# Altium schematic sheet Printing2.SchDoc
size A3; Organization: Altium Limited; Address1: L3, 12a Rodborough Rd; Address2: Frenchs Forest; Address3: NSW; Address4: Australia 2086
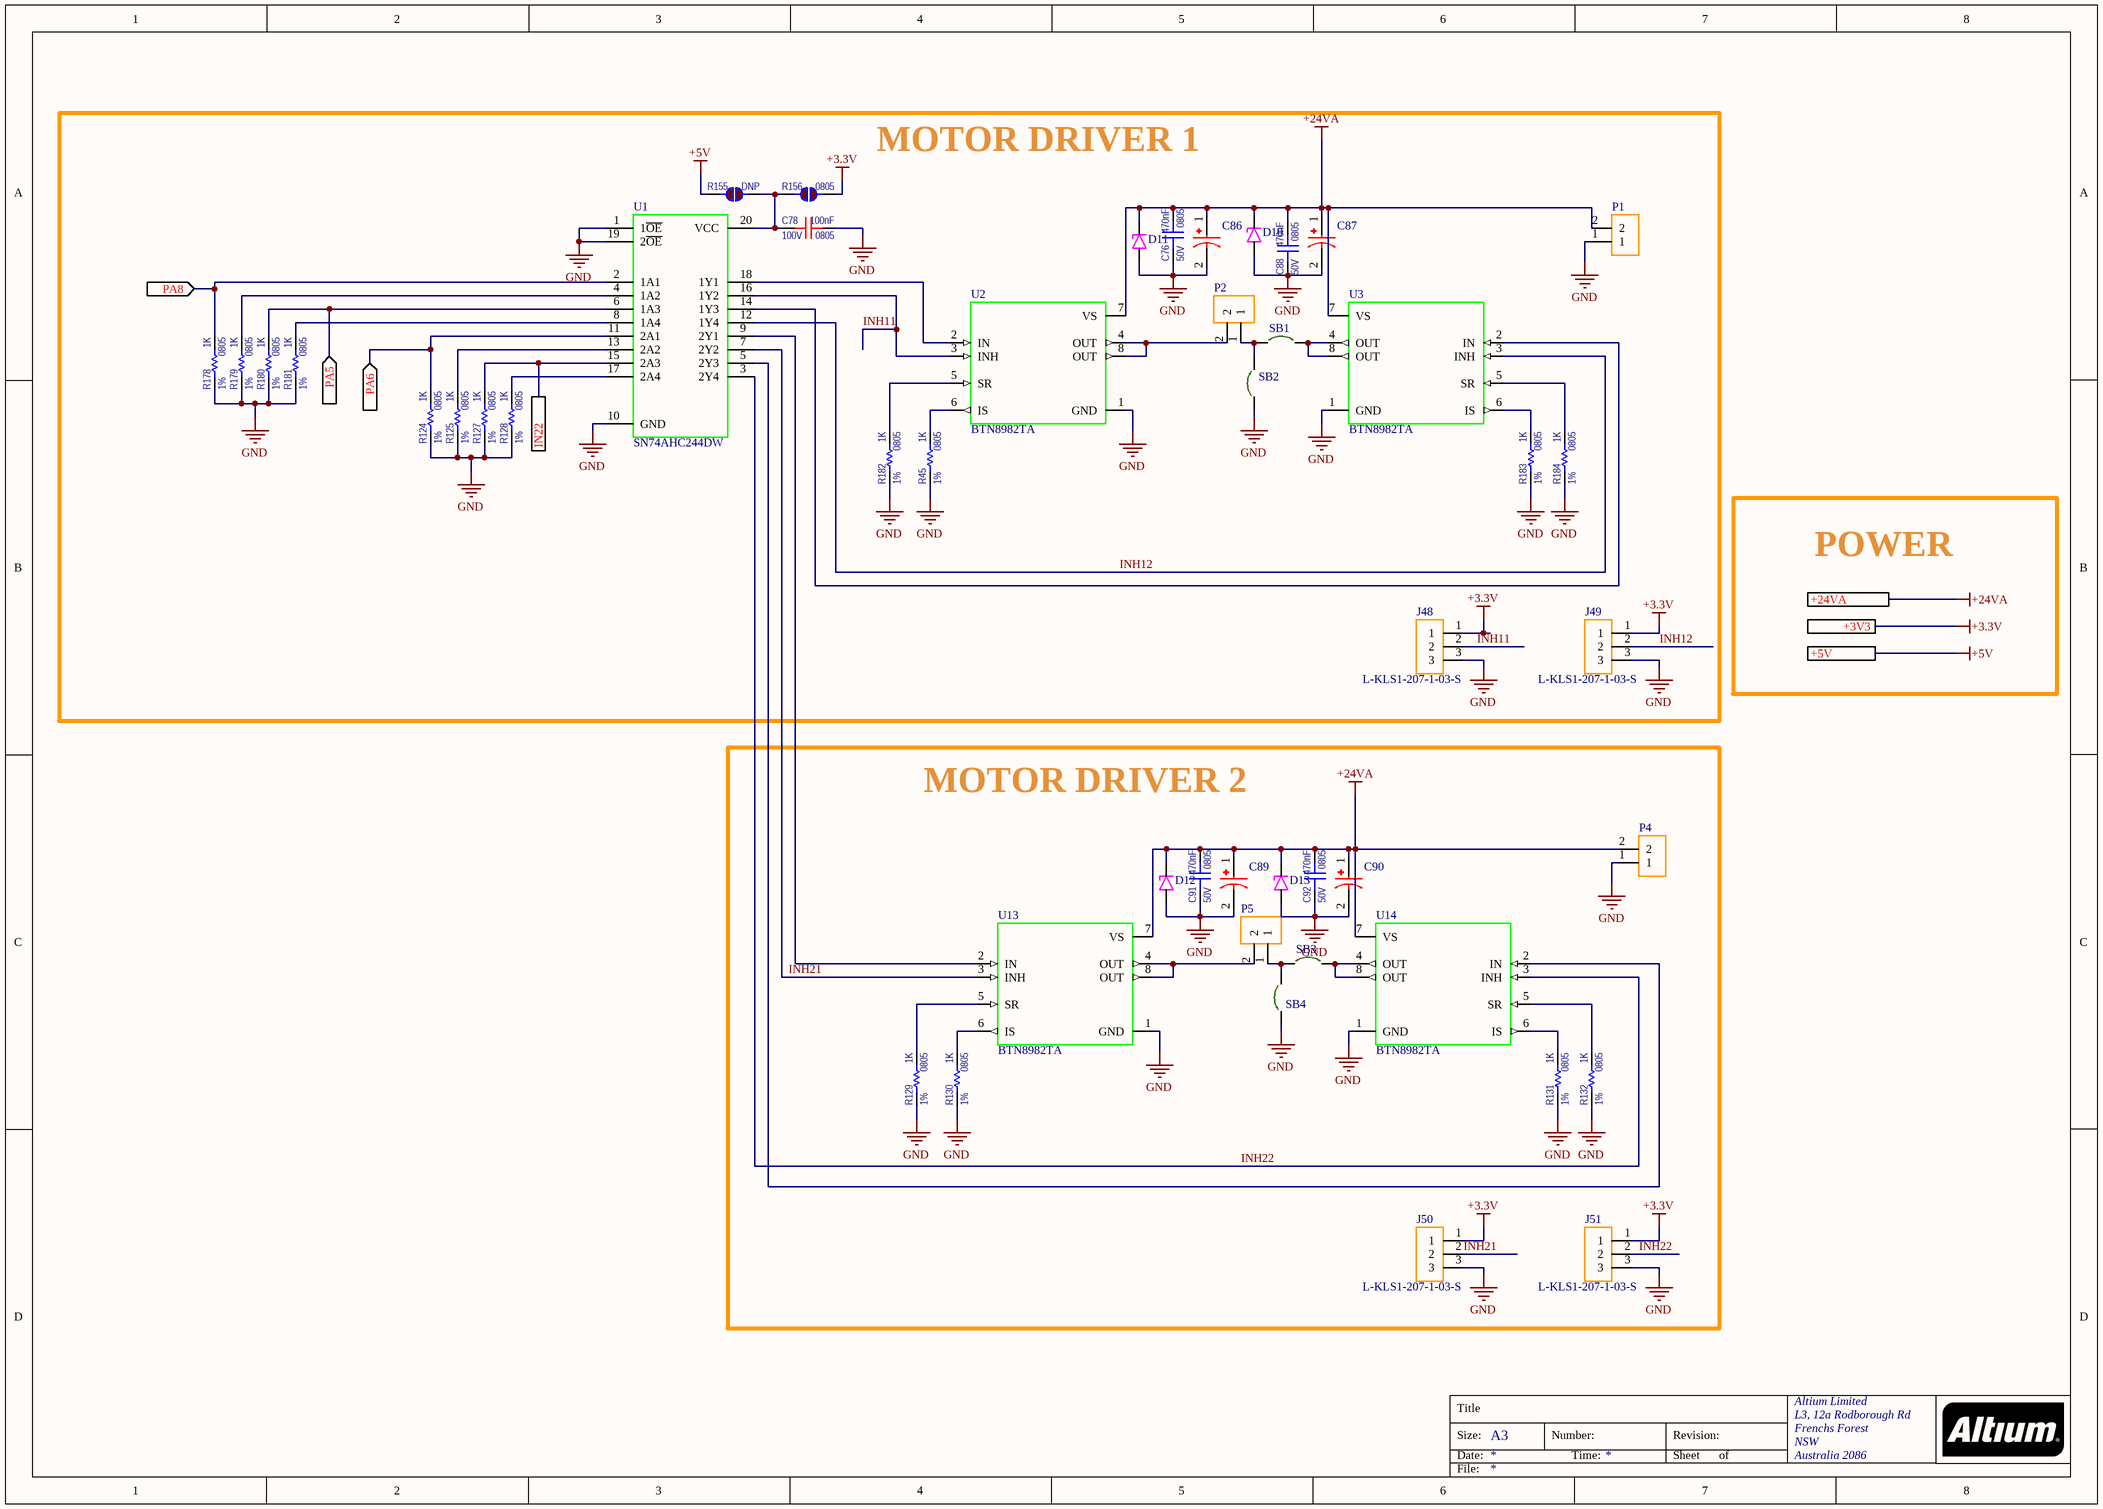
[diagram p0: Printing2.SchDoc]

## Parts
C76  value 470nF  Voltage: 50V  Package: 0805  [C_0805_GEN_1.10H]  (hidden comment: Capacitor)
C78  value 100nF  Voltage: 100V  Package: 0805  [C_0805_GEN_1.40H]  (hidden comment: ESDSafeCapacitor)
C86  100uF/50V  [SC1V107M6L07KVR]  (value not drawn)
C87  100uF/50V  [SC1V107M6L07KVR]  (value not drawn)
C88  value 470nF  Voltage: 50V  Package: 0805  [C_0805_GEN_1.10H]  (hidden comment: Capacitor)
C89  100uF/50V  [SC1V107M6L07KVR]  (value not drawn)
C90  100uF/50V  [SC1V107M6L07KVR]  (value not drawn)
C91  value 470nF  Voltage: 50V  Package: 0805  [C_0805_GEN_1.10H]  (hidden comment: Capacitor)
C92  value 470nF  Voltage: 50V  Package: 0805  [C_0805_GEN_1.10H]  (hidden comment: Capacitor)
D10  SMBJ30A-E3/52  [S2G_R1_00001]  (value not drawn)
D11  SMBJ30A-E3/52  [S2G_R1_00001]  (value not drawn)
D12  SMBJ30A-E3/52  [S2G_R1_00001]  (value not drawn)
D13  SMBJ30A-E3/52  [S2G_R1_00001]  (value not drawn)
J48  L-KLS1-207-1-03-S  [L-KLS1-207-1-03-S]
J49  L-KLS1-207-1-03-S  [L-KLS1-207-1-03-S]
J50  L-KLS1-207-1-03-S  [L-KLS1-207-1-03-S]
J51  L-KLS1-207-1-03-S  [L-KLS1-207-1-03-S]
P1  5.08 Klemens  [5.08 Klemens]  (value not drawn)
P2  5.08 Klemens  [5.08 Klemens]  (value not drawn)
P4  5.08 Klemens  [5.08 Klemens]  (value not drawn)
P5  5.08 Klemens  [5.08 Klemens]  (value not drawn)
R45  value 1K  Tolerance: 1%  Package: 0805  [R_0805_GEN_0.70H]  (hidden comment: StandardResistor)
R124  value 1K  Tolerance: 1%  Package: 0805  [R_0805_GEN_0.70H]  (hidden comment: StandardResistor)
R125  value 1K  Tolerance: 1%  Package: 0805  [R_0805_GEN_0.70H]  (hidden comment: StandardResistor)
R127  value 1K  Tolerance: 1%  Package: 0805  [R_0805_GEN_0.70H]  (hidden comment: StandardResistor)
R128  value 1K  Tolerance: 1%  Package: 0805  [R_0805_GEN_0.70H]  (hidden comment: StandardResistor)
R129  value 1K  Tolerance: 1%  Package: 0805  [R_0805_GEN_0.70H]  (hidden comment: StandardResistor)
R130  value 1K  Tolerance: 1%  Package: 0805  [R_0805_GEN_0.70H]  (hidden comment: StandardResistor)
R131  value 1K  Tolerance: 1%  Package: 0805  [R_0805_GEN_0.70H]  (hidden comment: StandardResistor)
R132  value 1K  Tolerance: 1%  Package: 0805  [R_0805_GEN_0.70H]  (hidden comment: StandardResistor)
R155  Package: DNP  [R_0805_GEN_0.70H]  (hidden comment: StandardJumper)
R156  Package: 0805  [R_0805_GEN_0.70H]  (hidden comment: StandardJumper)
R178  value 1K  Tolerance: 1%  Package: 0805  [R_0805_GEN_0.70H]  (hidden comment: StandardResistor)
R179  value 1K  Tolerance: 1%  Package: 0805  [R_0805_GEN_0.70H]  (hidden comment: StandardResistor)
R180  value 1K  Tolerance: 1%  Package: 0805  [R_0805_GEN_0.70H]  (hidden comment: StandardResistor)
R181  value 1K  Tolerance: 1%  Package: 0805  [R_0805_GEN_0.70H]  (hidden comment: StandardResistor)
R182  value 1K  Tolerance: 1%  Package: 0805  [R_0805_GEN_0.70H]  (hidden comment: StandardResistor)
R183  value 1K  Tolerance: 1%  Package: 0805  [R_0805_GEN_0.70H]  (hidden comment: StandardResistor)
R184  value 1K  Tolerance: 1%  Package: 0805  [R_0805_GEN_0.70H]  (hidden comment: StandardResistor)
SB1  (no value)  [0805_SB]
SB2  0805_SB  [0805_SB]  (value not drawn)
SB3  (no value)  [0805_SB]
SB4  (no value)  [0805_SB]
U1  SN74AHC244DW  [SN74AHC244DW]
U2  BTN8982TA  [DPAK127P1500X440-8N]
U3  BTN8982TA  [DPAK127P1500X440-8N]
U13  BTN8982TA  [DPAK127P1500X440-8N]
U14  BTN8982TA  [DPAK127P1500X440-8N]

## Blocks framed on the sheet
MOTOR DRIVER 1: C76 C78 C86-C88 D10 D11 J48 J49 P1 P2 R45 R124 R125 R127 R128 R155 R156 R178-R184 SB1 SB2 U1-U3
MOTOR DRIVER 2: C89-C92 D12 D13 J50 J51 P4 P5 R129-R132 SB3 SB4 U13 U14

## Ports
+3V3, +5V, +24VA, IN22, PA5 (in), PA6 (in), PA8 (in)

## Nets
+3.3V: J48.1 J49.1 J50.1 J51.1 R156.2 ; port +3V3
+5V: R155.1 ; port +5V
+24VA: C76.2 C86.1 C87.1 C88.2 C89.1 C90.1 C91.2 C92.2 D10.K D11.K D12.K D13.K P1.2 P4.2 U2.7(VS) U3.7(VS) U13.7(VS) U14.7(VS) ; port +24VA
GND: C76.1 C78.2 C86.2 C87.2 C88.1 C89.2 C90.2 C91.1 C92.1 D10.A D11.A D12.A D13.A J48.3 J49.3 J50.3 J51.3 P1.1 P4.1 R45.1 R124.1 R125.1 R127.1 R128.1 R129.1 R130.1 R131.1 R132.1 R178.1 R179.1 R180.1 R181.1 R182.1 R183.1 R184.1 SB2.1 SB4.1 U1.1(1~{OE}) U1.10(GND) U1.19(2~{OE}) U2.1(GND) U3.1(GND) U13.1(GND) U14.1(GND)
IN22: R127.2 U1.15(2A3) ; port IN22
INH11: J48.2 U1.16(1Y2) U2.3(INH)
INH12: J49.2 U1.12(1Y4) U3.3(INH)
INH21: J50.2 U1.7(2Y2) U13.3(INH)
INH22: J51.2 U1.3(2Y4) U14.3(INH)
PA5: R180.2 U1.6(1A3) ; port PA5
PA6: R124.2 U1.11(2A1) ; port PA6
PA8: R178.2 U1.2(1A1) ; port PA8
NetC78_1: C78.1 R155.2 R156.1 U1.20(VCC)
NetP2_1: P2.1 SB1.1 SB2.2
NetP2_2: P2.2 U2.4(OUT) U2.8(OUT)
NetP5_1: P5.1 SB3.1 SB4.2
NetP5_2: P5.2 U13.4(OUT) U13.8(OUT)
NetR45_2: R45.2 U2.6(IS)
NetR125_2: R125.2 U1.13(2A2)
NetR128_2: R128.2 U1.17(2A4)
NetR129_2: R129.2 U13.5(SR)
NetR130_2: R130.2 U13.6(IS)
NetR131_2: R131.2 U14.6(IS)
NetR132_2: R132.2 U14.5(SR)
NetR179_2: R179.2 U1.4(1A2)
NetR181_2: R181.2 U1.8(1A4)
NetR182_2: R182.2 U2.5(SR)
NetR183_2: R183.2 U3.6(IS)
NetR184_2: R184.2 U3.5(SR)
NetSB1_2: SB1.2 U3.4(OUT) U3.8(OUT)
NetSB3_2: SB3.2 U14.4(OUT) U14.8(OUT)
NetU1_5: U1.5(2Y3) U14.2(IN)
NetU1_9: U1.9(2Y1) U13.2(IN)
NetU1_14: U1.14(1Y3) U3.2(IN)
NetU1_18: U1.18(1Y1) U2.2(IN)

## Notes on the sheet
- POWER
- Title
- Size:
- Date:
- A3
- Number:
- Time:
- Revision:
- Sheet
- of
- File:

## Library data of the parts
C76 C88 C91 C92 = CER_470nF_#2: CAP_CER_470nF_50V_X7R_10%_0805; Manufacturer#1: Kemet; Manufacturer#1 PN: C0805C474K5RACAUTO; Manufacturer#2 PN: GCM21BR71H474KA55; Similar Part: CL21B474KBFVPNE; Added by: SonerI; FireANTs Code: C00122; Grade Level: Automotive; Lead Status: Pb-Free; Location: 3F6; Max Reflow Duration: 30; Max Reflow Temp: 260; Placement Area: 10.45; Power Rating: X; Temp# Operating: -55°C/+125°C; Tolerance: 10%; Identifier: CER_470nF_#2; Checked by: İlkerU; ComponentLink1Description: Resource Folder; ComponentLink1URL: C:\FireANTs_Repo\HW_Lib\trunk\ComponentLibrary\Resources\Capacitors\C00122; Cost: 0.32; Current: N/A; Failure in Time: N/A; Features: AEC-Q200; Height: 1.10; Manufacturer#2: Murata; MSL: 1; Mounting Type: SMD; Part Status: Active; Temp# Storage: N/A; Weight: 17mg
C78 = CER_100nF_#4: CAP_CER_100nF_100V_X7R_10%_0805; Manufacturer#1: Kemet; Manufacturer#1 PN: C0805C104K1RECAUTO; Manufacturer#2 PN: ESD51C104K4T2A-24; Similar Part: C0805C104J1RECAUTO7210; C0805X104J1RECAUTO; Added by: İlhanT; FireANTs Code: C00062; Grade Level: Automotive; Lead Status: Pb-Free; Location: 3B16; Max Reflow Duration: 30; Max Reflow Temp: 260; Placement Area: 10.45; Power Rating: X; Temp# Operating: -55°C/+125°C; Tolerance: 10%; Identifier: CER_100nF_#4; Checked by: İlkerU; ComponentLink1Description: Resource Folder; ComponentLink1URL: C:\FireANTs_Repo\HW_Lib\trunk\ComponentLibrary\Resources\Capacitors\C00062; Cost: 0.27; Current: N/A; Failure in Time: N/A; Features: AEC-Q200; ESD withstanding; Height: 1.40; Manufacturer#2: AVX; MSL: 1; Mounting Type: SMD; Part Status: Active; Temp# Storage: N/A; Weight: 19mg
C86 C87 C89 C90 = SC1V107M6L07KVR
D10-D13 = SMBJ30A-E3/52: TVS DIODE 30VWM 48.4VC SMB; Manufacturer: Vishay Semiconductors; Breakdown Voltage: 36.8V; Number of Elements: 1; Direction: Unidirectional; Reverse Breakdown Voltage: 33.3V; Operating Supply Voltage: 30V; Max Surge Current: 12.4A; Clamping Voltage: 48.4V; Peak Pulse Power: 600W; Test Current: 1mA; Max Reverse Leakage Current: 1uA; Element Configuration: Single; Power Line Protection: No; Diode Type: ZENER; Supplier 1: Rs; Manufacturer Part Number: SMBJ30A-E3/52; RoHS: Yes; Category: TVS Diodes; Stock 1: 1; Mount: Surface Mount; Case/Package: DO-214AA; Number of Pins: 2; Min Operating Temperature: -55°C; Max Operating Temperature: 150°C; Packaging: Tape and Reel; Package Quantity: 750; Reverse Standoff Voltage: 30V; Polarity: Unidirectional; Number of Channels: 1; Peak Pulse Current: 12.4A; Min Breakdown Voltage: 33.3V; Max Breakdown Voltage: 36.8V; Max Power Dissipation: 600W; Power Dissipation: 600W; Leakage Current: 1uA; Clamping Voltage-Max: 48.4V; Termination: SMD/SMT; Resistor Type: Zener; Number of Unidirectional Channels: 1; Series: TransZorb®; Length: 4.57mm; Width: 3.94mm; Height: 2.24mm; Radiation Hardening: No; Lead Free: Lead Free; RoHS Compliant: Yes; ComponentLink1URL: https://datasheet.ciiva.com/28654/1691222-28654369.pdf?src-supplier=Element14; ComponentLink1Description: https://datasheet.ciiva.com/28654/1691222-28654369.pdf?src-supplier=Element14; ComponentLink2URL: https://datasheet.ciiva.com/26322/139043-26322383.pdf?src-supplier=Element14; ComponentLink2Description: https://datasheet.ciiva.com/26322/139043-26322383.pdf?src-supplier=Element14; ComponentLink3URL: https://datasheet.ciiva.com/26322/139043-26322382.pdf?src-supplier=Element14; ComponentLink3Description: https://datasheet.ciiva.com/26322/139043-26322382.pdf?src-supplier=Element14; ComponentLink4URL: https://datasheet.ciiva.com/330/smbj50a-330951.pdf?src-supplier=Digi-Key; ComponentLink4Description: https://datasheet.ciiva.com/330/smbj50a-330951.pdf?src-supplier=Digi-Key; ComponentLink5URL: https://datasheet.ciiva.com/330/smbj50a-330952.pdf?src-supplier=Digi-Key; ComponentLink5Description: https://datasheet.ciiva.com/330/smbj50a-330952.pdf?src-supplier=Digi-Key; ComponentLink6URL: https://datasheet.ciiva.com/330/smbj50a-330950.pdf?src-supplier=Digi-Key; ComponentLink6Description: https://datasheet.ciiva.com/330/smbj50a-330950.pdf?src-supplier=Digi-Key; Supplier Part Number 1: 0229762P
R45 R124 R125 R127-R132 R178-R184 = STD_1K_#2: RES_STD_1K_0.125W_1%_100ppm_0805; Manufacturer#1: Yageo; Manufacturer#1 PN: AC0805FR-071KL; Manufacturer#2 PN: ERJ-6ENF1001V; Added by: SonerI; FireANTs Code: R00102; Current: X; Grade Level: Automotive; Lead Status: Pb-Free; Location: 2F1; Max Reflow Duration: 10; Max Reflow Temp: 260; Placement Area: 10.45; Power Rating: 125mW; Temp# Operating: -55°C/+155°C; Voltage: 150V; Identifier: STD_1K_#2; Checked by: YasinY; ComponentLink1Description: Resource Folder; ComponentLink1URL: C:\FireANTs_Repo\HW_Lib\trunk\ComponentLibrary\Resources\Resistors\R00102; Cost: 0.10; Failure in Time: N/A; Features: AEC-Q200; Height: 0.70; Manufacturer#2: Panasonic; MSL: 1; Mounting Type: SMD; Part Status: Active; Similar Part: N/A; Temp# Storage: N/A; Weight: 5.5mg
R155 R156 = STD_JUMPER_#3: RES_STD_0R_0.125W_0805; Manufacturer#1: Yageo; Manufacturer#1 PN: AC0805JR-070RL; Manufacturer#2 PN: ERJ-6GEY0R00V; Value: 0R; Added by: İlhanT; FireANTs Code: R00008; Current: X; Grade Level: Automotive; Lead Status: Pb-Free; Location: 2D2; Max Reflow Duration: 10; Max Reflow Temp: 260; Placement Area: 10.45; Power Rating: 125mW; Temp# Operating: -55°C/+155°C; Tolerance: 5%; Voltage: 150V; Identifier: STD_JUMPER_#3; Checked by: YasinY; ComponentLink1Description: Resource Folder; ComponentLink1URL: C:\FireANTs_Repo\HW_Lib\trunk\ComponentLibrary\Resources\Resistors\R00008; Cost: 0.10; Failure in Time: N/A; Features: AEC-Q200; Height: 0.70; Manufacturer#2: Panasonic; MSL: 1; Mounting Type: SMD; Part Status: Active; Similar Part: N/A; Temp# Storage: N/A; Weight: 5.5mg
SB1 SB3 SB4 = 0805_SB
U1 = SN74AHC244DW: Buffer/Line Driver 8-CH Non-Inverting 3-ST CMOS 20-Pin SOIC Tube; Manufacturer: Texas Instruments; Number of Channels: 8; Max Supply Voltage: 5.5V; Min Supply Voltage: 2V; Propagation Delay: 16ns; Number of Elements: 2; Logic Function: Buffer,Inverting; Number of Bits per Element: 4; High Level Output Current: -8mA; Low Level Output Current: 8mA; Turn-On Delay Time: 11.9ns; Quiescent Current: 4uA; Output Type: 3-STATE; Supplier 1: Arrow Electronics; Manufacturer Part Number: SN74AHC244DW; RoHS: Yes; Category: Buffers, Drivers and Transceivers; Stock 1: 5; Pricing 1: 1=0,84130, 10=0,80590, 25=0,78200, 50=0,77410, 100=0,71270, 250=0,68820, 500=0,54870 (USD); Mount: Surface Mount; Case/Package: SOIC; Number of Pins: 20; Min Operating Temperature: -40°C; Max Operating Temperature: 85°C; Number of Inputs: 8; Number of Outputs: 8; Packaging: Rail/Tube; Package Quantity: 25; Number of Input Lines: 8; Number of Output Lines: 8; Polarity: Non-Inverting; Series: 74AHC; Technology: CMOS; Number of Bits: 8; Termination: SMD/SMT; Number of Circuits: 8; Length: 12.8mm; Width: 7.52mm; Height: 2.35mm; Radiation Hardening: No; Lead Free: Lead Free; RoHS Compliant: Yes; Reach SVHC Compliant: Yes; ComponentLink1URL: https://datasheet.ciiva.com/1620/sn74ahc244-1620321.pdf?src-supplier=Newark; ComponentLink1Description: https://datasheet.ciiva.com/1620/sn74ahc244-1620321.pdf?src-supplier=Newark; ComponentLink2URL: https://datasheet.ciiva.com/15094/getdatasheetpartid-49308-15094305.pdf?src-supplier=Verical; ComponentLink2Description: https://datasheet.ciiva.com/15094/getdatasheetpartid-49308-15094305.pdf?src-supplier=Verical; ComponentLink3URL: https://datasheet.ciiva.com/7748/1815001-7748028.pdf?src-supplier=Element14; ComponentLink3Description: https://datasheet.ciiva.com/7748/1815001-7748028.pdf?src-supplier=Element14; ComponentLink4URL: https://datasheet.ciiva.com/1835/sn74ahc244-1835217.pdf?src-supplier=Digi-Key; ComponentLink4Description: https://datasheet.ciiva.com/1835/sn74ahc244-1835217.pdf?src-supplier=Digi-Key; ComponentLink5URL: https://datasheet.ciiva.com/14301/sn54ahc244-14301307.pdf?src-supplier=Avnet; ComponentLink5Description: https://datasheet.ciiva.com/14301/sn54ahc244-14301307.pdf?src-supplier=Avnet; Supplier Part Number 1: SN74AHC244DW
U2 U3 U13 U14 = BTN8982TA: Motor / Motion / Ignition Controllers & Drivers TRILITH IC / NOVALITH IC; MF: Infineon Technologies; Price: None; Availability: In Stock; MP: BTN8982TA; Package: TO-263-8 Infineon Technologies; SnapEDA_Link: https://www.snapeda.com/parts/BTN8982TA/Infineon+Technologies/view-part/?ref=snap; Check_prices: https://www.snapeda.com/parts/BTN8982TA/Infineon+Technologies/view-part/?ref=eda; Value: *; Purchase-URL: https://pricing.snapeda.com/search/part/BTN8982TA/?ref=eda